# Altium schematic sheet 1.WM-N400MSE.SchDoc: 1.WM-N400MSE_Starter_kit_V002
size A3; DrawnBy: Mason; Revision: V002; SheetNumber: 1; SheetTotal: 2; Team: Gateway; ProjectName: WM-N400MSE_Starter_kit_V002
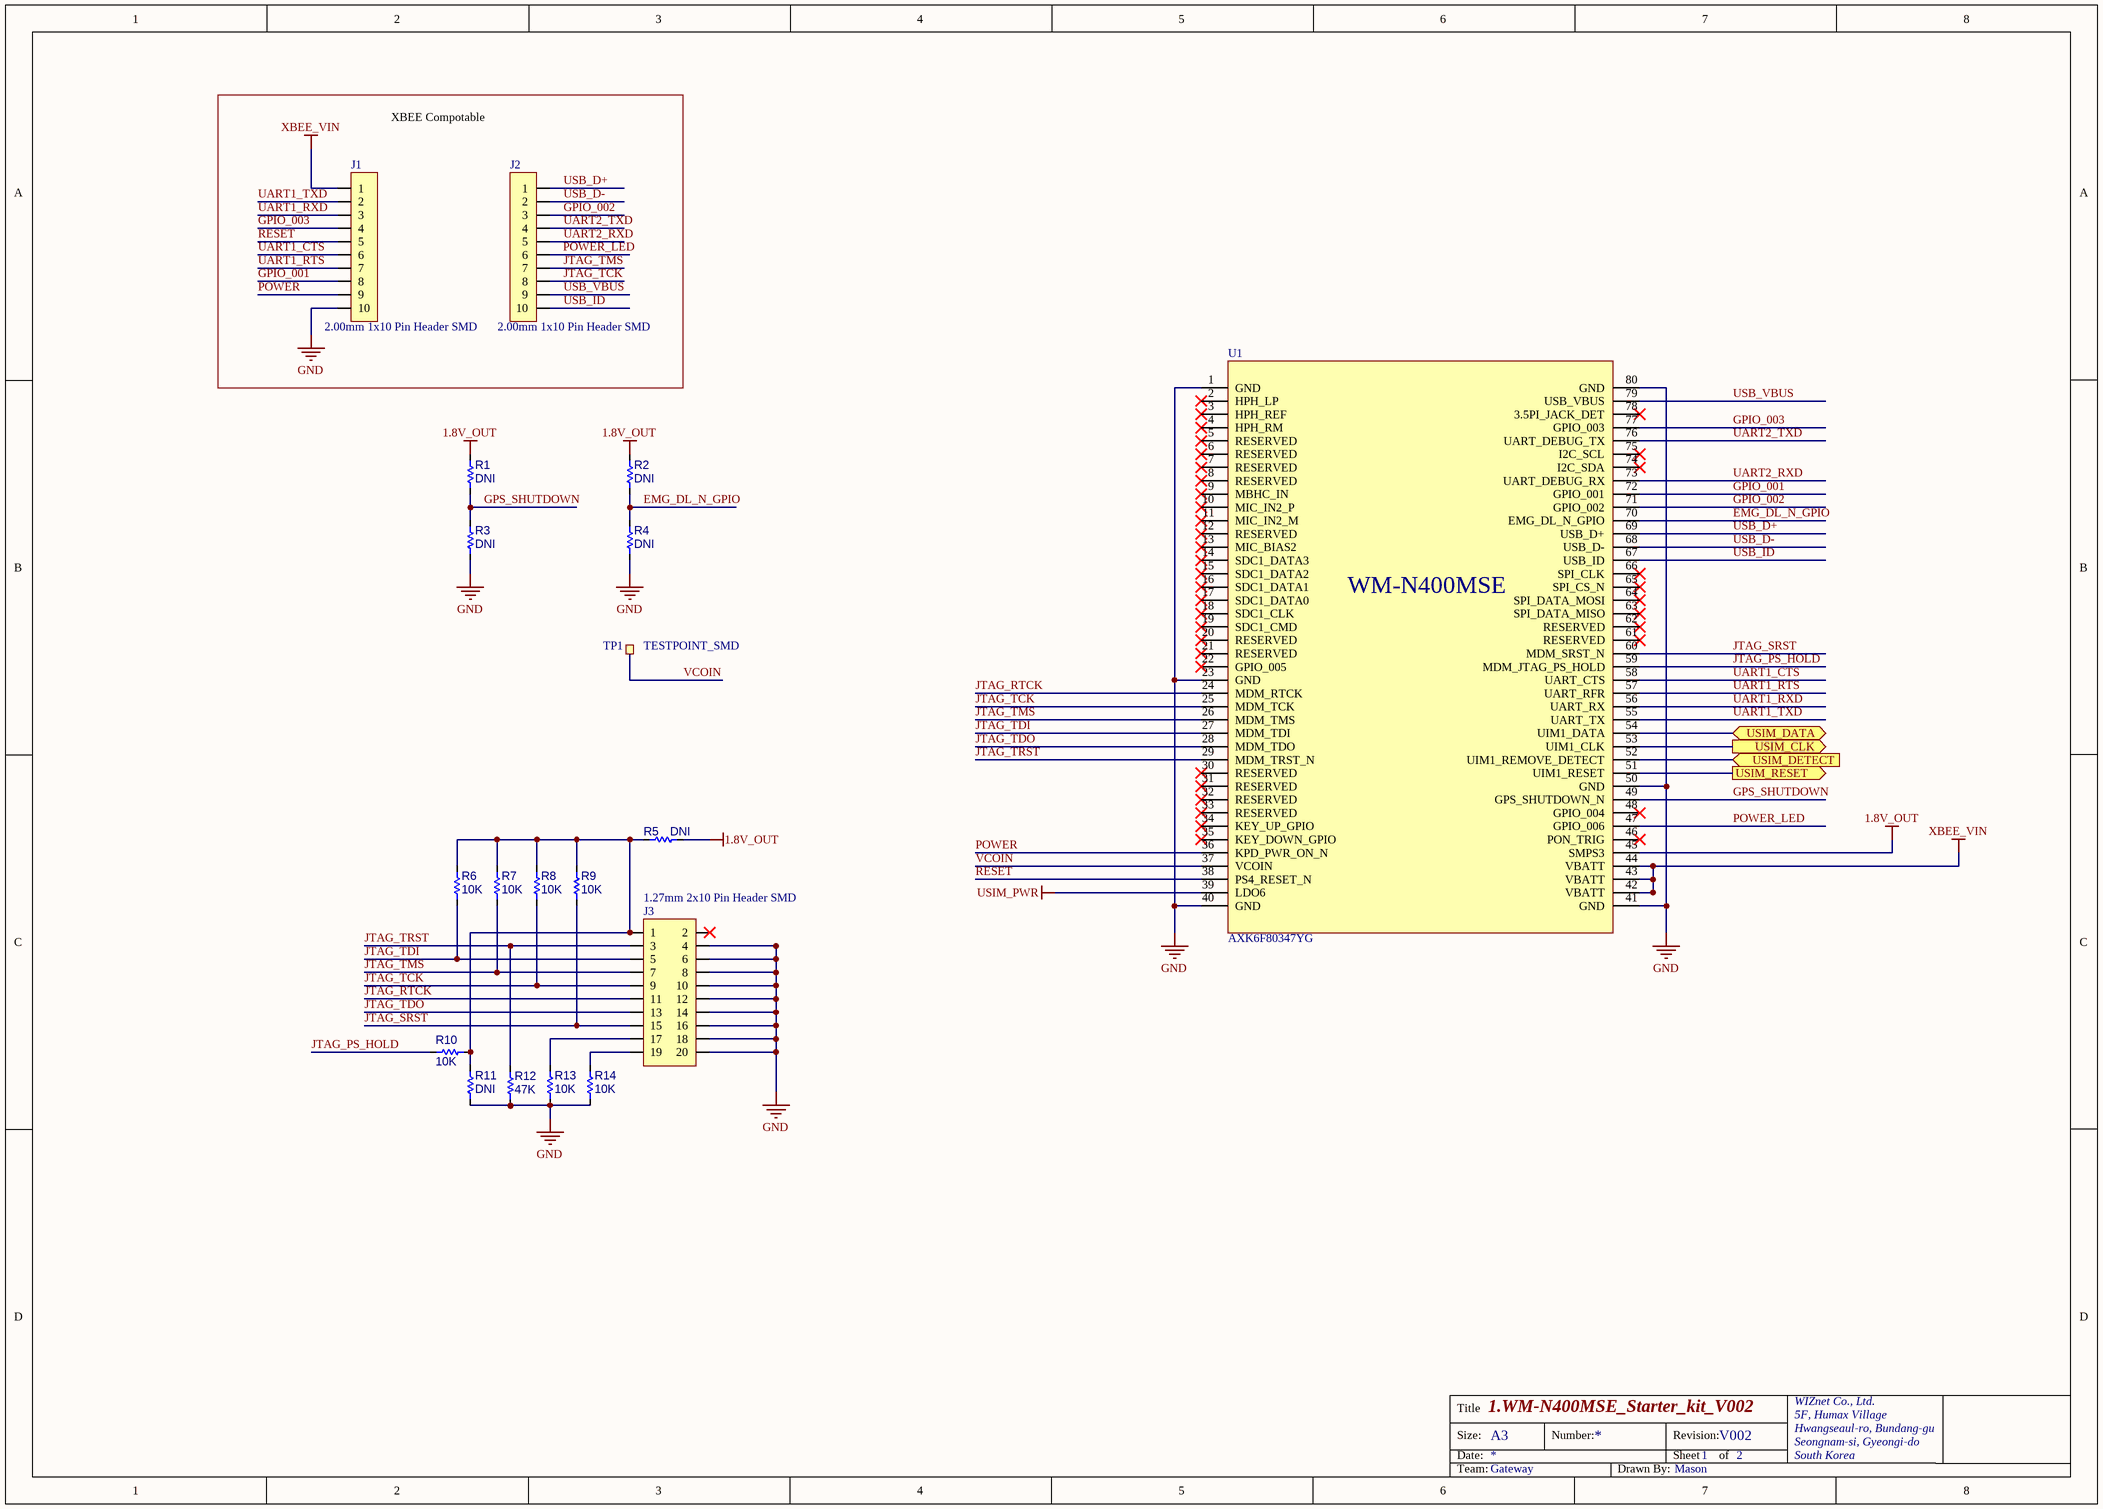
[diagram p0: 1.WM-N400MSE.SchDoc]

## Parts
J1  2.00mm 1x10 Pin Header SMD  [IDC(SMD)-1X10(2MM)]
J2  2.00mm 1x10 Pin Header SMD  [IDC(SMD)-1X10(2MM)]
J3  1.27mm 2x10 Pin Header SMD  [IDC(SMD)-2X10(1.27MM)]
R1  DNI  [RES-0402]
R2  DNI  [RES-0402]
R3  DNI  [RES-0402]
R4  DNI  [RES-0402]
R5  DNI  [RES-0402]
R6  10K  [RES-0402]
R7  10K  [RES-0402]
R8  10K  [RES-0402]
R9  10K  [RES-0402]
R10  10K  [RES-0402]
R11  DNI  [RES-0402]
R12  47K  [RES-0402]
R13  10K  [RES-0402]
R14  10K  [RES-0402]
TP1  TESTPOINT_SMD  [TP(SMD)-1PI]
U1  AXK6F80347YG  [WM-N400MSE]

## Ports
USIM_CLK (out), USIM_DATA (bidir), USIM_DETECT (in), USIM_RESET (out)

## Nets
1.8V_OUT: R1.2 R2.2 R5.1 U1.45(SMPS3)
GND: J1.10 J3.4 J3.6 J3.8 J3.10 J3.12 J3.14 J3.16 J3.18 J3.20 R3.1 R4.1 R11.1 R12.1 R13.1 R14.1 U1.1(GND) U1.23(GND) U1.40(GND) U1.41(GND) U1.50(GND) U1.80(GND)
USIM_PWR: U1.39(LDO6)
XBEE_VIN: J1.1 U1.42(VBATT) U1.43(VBATT) U1.44(VBATT)
EMG_DL_N_GPIO: R2.1 R4.2 U1.70(EMG_DL_N_GPIO)
GPIO_001: J1.8 U1.72(GPIO_001)
GPIO_002: J2.3 U1.71(GPIO_002)
GPIO_003: J1.4 U1.77(GPIO_003)
GPS_SHUTDOWN: R1.1 R3.2 U1.49(GPS_SHUTDOWN_N)
JTAG_PS_HOLD: R10.2 U1.59(MDM_JTAG_PS_HOLD)
JTAG_RTCK: J3.11 U1.24(MDM_RTCK)
JTAG_SRST: J3.15 R9.1 U1.60(MDM_SRST_N)
JTAG_TCK: J2.8 J3.9 R8.1 U1.25(MDM_TCK)
JTAG_TDI: J3.5 R6.1 U1.27(MDM_TDI)
JTAG_TDO: J3.13 U1.28(MDM_TDO)
JTAG_TMS: J2.7 J3.7 R7.1 U1.26(MDM_TMS)
JTAG_TRST: J3.3 R12.2 U1.29(MDM_TRST_N)
POWER: J1.9 U1.36(KPD_PWR_ON_N)
POWER_LED: J2.6 U1.47(GPIO_006)
RESET: J1.5 U1.38(PS4_RESET_N)
UART1_CTS: J1.6 U1.58(UART_CTS)
UART1_RTS: J1.7 U1.57(UART_RFR)
UART1_RXD: J1.3 U1.56(UART_RX)
UART1_TXD: J1.2 U1.55(UART_TX)
UART2_RXD: J2.5 U1.73(UART_DEBUG_RX)
UART2_TXD: J2.4 U1.76(UART_DEBUG_TX)
USB_D+: J2.1 U1.69(USB_D+)
USB_D-: J2.2 U1.68(USB_D-)
USB_ID: J2.10 U1.67(USB_ID)
USB_VBUS: J2.9 U1.79(USB_VBUS)
USIM_CLK: U1.53(UIM1_CLK) ; port USIM_CLK
USIM_DATA: U1.54(UIM1_DATA) ; port USIM_DATA
USIM_DETECT: U1.52(UIM1_REMOVE_DETECT) ; port USIM_DETECT
USIM_RESET: U1.51(UIM1_RESET) ; port USIM_RESET
VCOIN: TP1.1(TETSPOINT) U1.37(VCOIN)
NetJ3_1: J3.1 R5.2 R6.2 R7.2 R8.2 R9.2 R10.1 R11.2
NetJ3_17: J3.17 R13.2
NetJ3_19: J3.19 R14.2

Not connected (* = marked no-connect by the designer): J3 2*; U1 2(HPH_LP)* 3(HPH_REF)* 4(HPH_RM)* 5(RESERVED)* 6(RESERVED)* 7(RESERVED)* 8(RESERVED)* 9(MBHC_IN)* 10(MIC_IN2_P)* 11(MIC_IN2_M)* 12(RESERVED)* 13(MIC_BIAS2)* 14(SDC1_DATA3)* 15(SDC1_DATA2)* 16(SDC1_DATA1)* 17(SDC1_DATA0)* 18(SDC1_CLK)* 19(SDC1_CMD)* 20(RESERVED)* 21(RESERVED)* 22(GPIO_005)* 30(RESERVED)* 31(RESERVED)* 32(RESERVED)* 33(RESERVED)* 34(KEY_UP_GPIO)* 35(KEY_DOWN_GPIO)* 46(PON_TRIG)* 48(GPIO_004)* 61(RESERVED)* 62(RESERVED)* 63(SPI_DATA_MISO)* 64(SPI_DATA_MOSI)* 65(SPI_CS_N)* 66(SPI_CLK)* 74(I2C_SDA)* 75(I2C_SCL)* 78(3.5PI_JACK_DET)*

## Notes on the sheet
- XBEE Compotable
- Title
- Size:
- Date:
- A3
- Number:
- Revision:
- Sheet
- of
- WIZnet Co., Ltd.
- 5F, Humax Village
- Hwangseaul-ro, Bundang-gu
- Seongnam-si, Gyeongi-do
- South Korea
- Team:
- Drawn By:

## Library data of the parts
R1-R14 = RES-0402
TP1 = TESTPOINT_SMD: TEST POINT
U1 = WM-N400MSE